# EAGLE design TeamFlag (EAGLE 7.6.0)
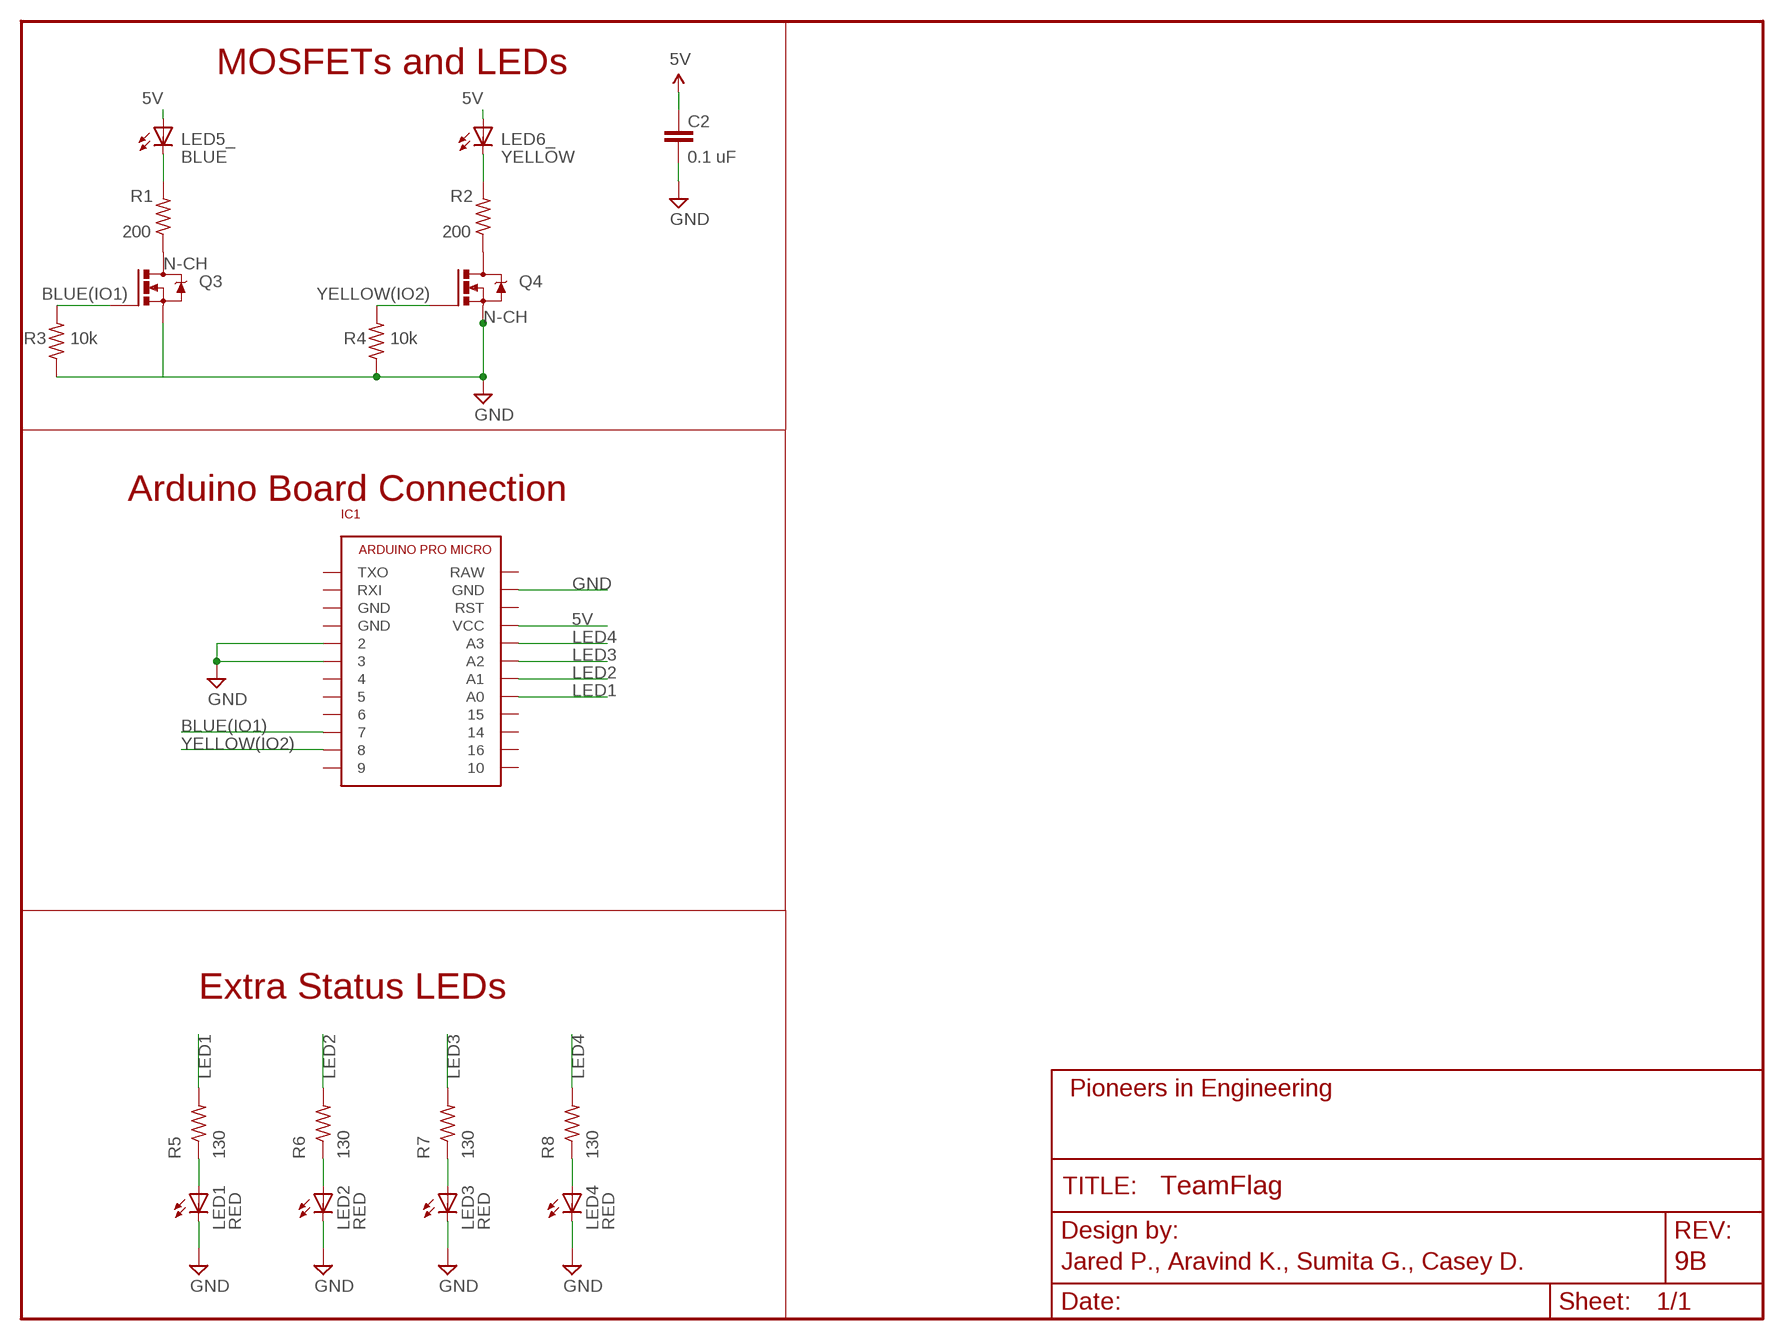
[diagram p0: schematic, sheet 1]
FRAME1 (FRAME_SCHEMATIC): AUTHOR: Jared P., Aravind K., Sumita G., Casey D.; REVISION: 9B

## Parts
C2  0.1 uF  CAP0603-CAP  [0603-CAP]
IC1  ARDUINO_PRO_MICROSMD  [ARDUINO_PRO_MICRO_SM]
LED1  RED  LED0805  [LED-0805]
LED2  RED  LED0805  [LED-0805]
LED3  RED  LED0805  [LED-0805]
LED4  RED  LED0805  [LED-0805]
LED5_  BLUE  LEDLED5MM-NOFLAT  [LED5MM-NOFLAT]
LED6_  YELLOW  LEDLED5MM-NOFLAT  [LED5MM-NOFLAT]
Q3  N-CH  N-CHANNEL-MOSFETSOT23-3  [SOT23-3]
Q4  N-CH  N-CHANNEL-MOSFETSOT23-3  [SOT23-3]
R1  200  R-US_R0603  [R0603]
R2  200  R-US_R0603  [R0603]
R3  10k  R-US_R0603  [R0603]
R4  10k  R-US_R0603  [R0603]
R5  130  R-US_R0603  [R0603]
R6  130  R-US_R0603  [R0603]
R7  130  R-US_R0603  [R0603]
R8  130  R-US_R0603  [R0603]

## Nets
5V: C2.1 IC1.VCC LED5_.A LED6_.A
BLUE(IO1): IC1.7 Q3.1(G) R3.2
BSOURCE: Q3.3(D) R1.1
GND: C2.2 IC1.2 IC1.3 IC1.GND@2(GND) LED1.C LED2.C LED3.C LED4.C Q3.2(S) Q4.2(S) R3.1 R4.1
LED1: IC1.A0 R5.2
LED1R: LED1.A R5.1
LED2: IC1.A1 R6.2
LED2R: LED2.A R6.1
LED3: IC1.A2 R7.2
LED3R: LED3.A R7.1
LED4: IC1.A3 R8.2
LED4R: LED4.A R8.1
N$2: LED5_.K(C) R1.2
N$3: LED6_.K(C) R2.2
YELLOW(IO2): IC1.8 Q4.1(G) R4.2
YSOURCE: Q4.3(D) R2.1
Unconnected: IC1.4 IC1.5 IC1.6 IC1.9 IC1.10 IC1.14 IC1.15 IC1.16 IC1.GND IC1.GND@1(GND) IC1.RAW IC1.RST IC1.RX(RXI) IC1.TX(TXO)

## Notes on the sheet
- MOSFETs and LEDs
- Arduino Board Connection
- Extra Status LEDs

## Library data of the parts
C2 = pie:CAP: Capacitor Standard 0603 ceramic capacitor, and 0.1" leaded capacitor.; PIE-INT-REF-NUM: CAPACITOR-GENERIC
IC1 = pie:ARDUINO_PRO_MICRO: Arduino Pro Micro Electrical System Year 9's Smart Sensor Core Pin Outs <https://cdn.sparkfun.com/assets/9/c/3/c/4/523a1765757b7f5c6e8b4567.png> Buy Here <http://www.aliexpress.com/item/Mini-Leonardo-Pro-Micro-ATmega32U4-5V-16MHz-Module-For-Arduino-Best-Quality/32284746884.html?ws_ab_test=searchweb201556_8,searchweb201602_2_10057_10056_10065_10055_10054_10067_10069_10059_10058_10017_10070_10060_10061_10052_10062_10053_10050_10051,searchweb201603_1&btsid=45993952-29ca-4de4-a0fb-c7fb72b8e1a5> Thru Hole Female Pins <http://www.digikey.com/product-search/en?keywords=929974E-01-12-ND> Surface Mount Female Pins <http://www.digikey.com/product-detail/en/sullins-connector-solutions/NPTC121KFXC-RC/S5604-ND/776062>
LED1-LED4 LED5_ LED6_ = pie:LED: LEDs Standard schematic elements and footprints for 5mm, 3mm, 1206, and 0603 sized LEDs. 5mm - Spark Fun Electronics SKU : COM-00529 (and others); PIE-INT-REF-NUM: LED
Q3 Q4 = pie:N-CHANNEL-MOSFET: N-channel TrenchMOS (TM) logic level FET Source: SOT23-3: http://www.nxp.com/documents/data_sheet/BSS123.pdf SOT669: http://www.nxp.com/documents/data_sheet/PH7030L.pdf
R1-R8 = pie:R-US_: RESISTOR, American symbol; DESCRIPTION: RESISTOR, American symbol; DISTRIBUTOR: DigiKey; MANUFACTURER: Rohm Semiconductor; NOTES: Cut Tape; PACKAGE: R0603; VALUE: >VALUE

## Board
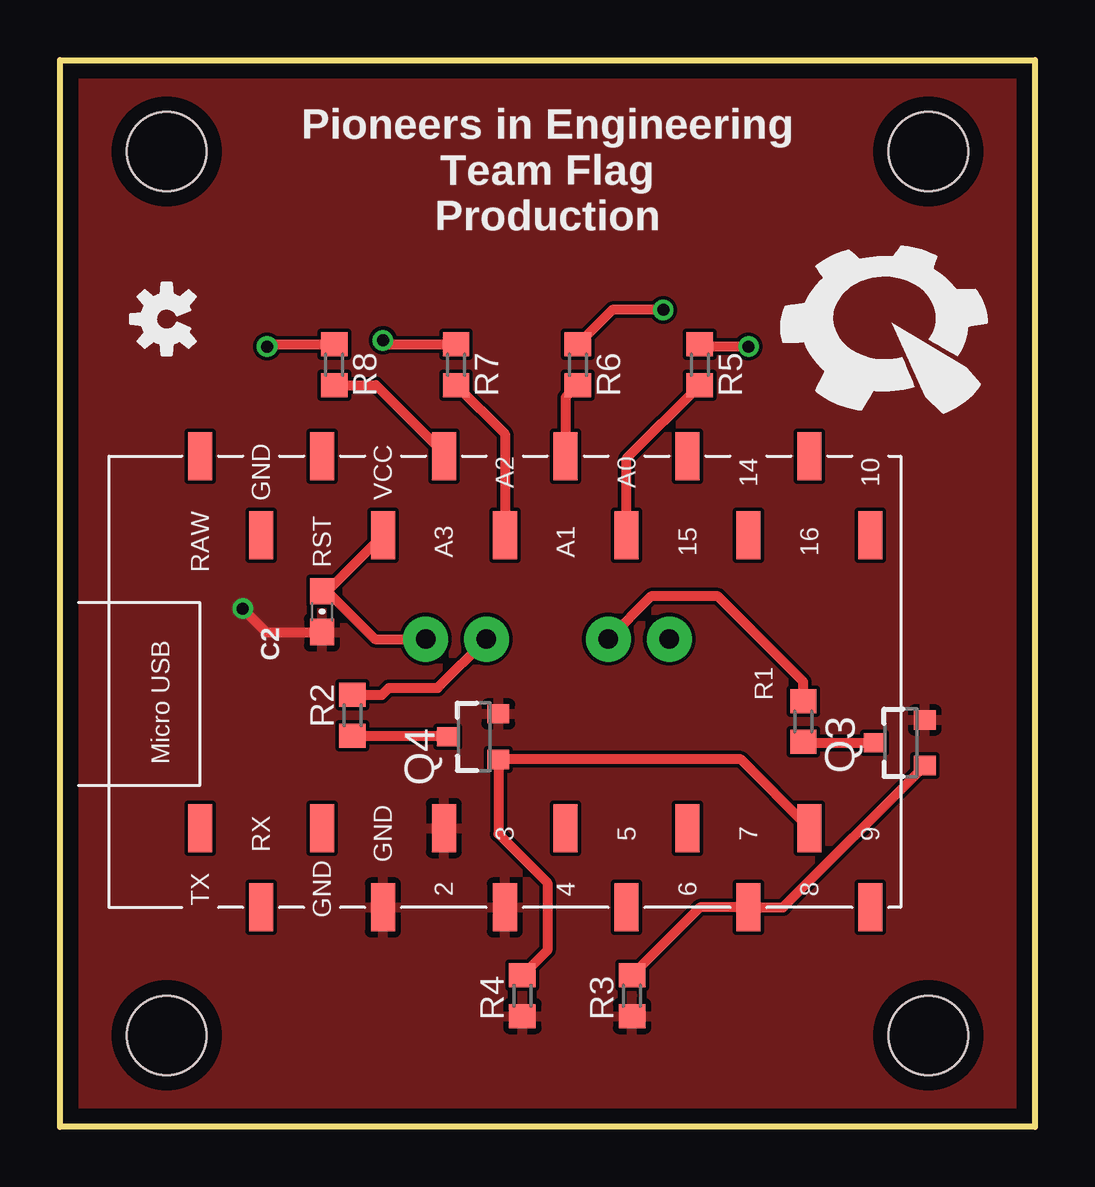
[diagram p1: board, top side]
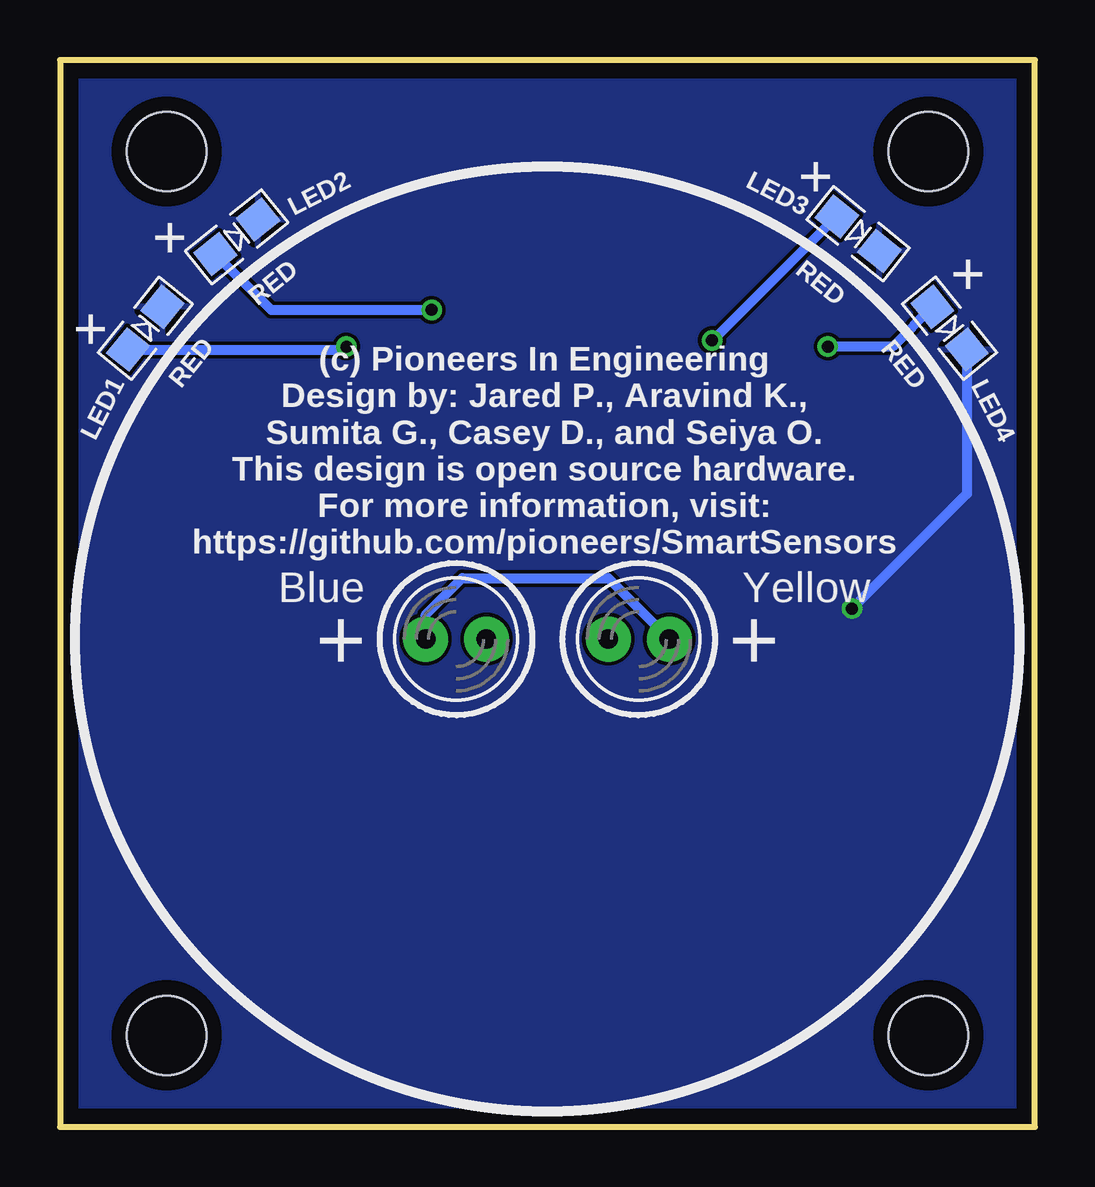
[diagram p2: board, bottom side, seen from below]

Size 40.64 x 44.45 mm. Coordinates in mm from the lower left corner, seen from the top.
Outline: 40.64,0 0,0 0,44.45 40.64,44.45 40.64,0
Copper layers (1*16): Top 2mil / dielectric 9mil / Bottom 2mil
Design rules "advancedcircuits-33each-pie": minimum track width 6mil, minimum drill 15mil, track to track 6mil, track to pad 6mil, pad to pad 6mil, via to via 6mil, smd to smd 6mil, copper to edge 25mil, drill to drill 7mil, minimum pad ring 7mil, minimum via ring 7mil, stop-mask expansion 3mil, vias tented up to drill 21mil, thermal gap 10mil

### Footprints (pad centres in the part's own frame; a part is rotated, then mirrored left to right if it is on the bottom)
0603-CAP = smd 1.1 x 1: 1 -0.85,0; 2 0.85,0
ARDUINO_PRO_MICRO_SM = smd 2 x 1: 2 3.302,19.05; 3 0,16.51; 4 3.302,13.97; 5 0,11.43; 6 3.302,8.89; 7 0,6.35; 8 3.302,3.81; 9 0,1.27; 10 15.494,1.27; 14 15.494,6.35; 15 18.796,8.89; 16 18.796,3.81; A0 15.494,11.43; A1 18.796,13.97; A2 15.494,16.51; A3 18.796,19.05; GND 15.494,26.67; GND@1 3.302,24.13; GND@2 0,21.59; RAW 18.796,29.21; RST 18.796,24.13; RX 0,26.67; TX 3.302,29.21; VCC 15.494,21.59
LED-0805 = smd 1.397 x 1.245: A -1.143,0; C 1.143,0
LED5MM-NOFLAT = drill 0.813 pad 1.88: A -1.27,0; K 1.27,0
SOT23-3 = smd 0.8 x 0.9: 1 -0.95,-1; 2 0.95,-1; 3 0,1.1
R0603 = smd 1 x 1.1: 1 -0.85,0; 2 0.85,0
STAND-OFF = hole 3.302: 0,0

### Placement (x,y rotation side)
C2  10.92,21.46 270 top
IC1  35.05,9.14 90 top
LED1  37.08,33.27 51 bottom
LED2  33.27,37.08 39 bottom
LED3  7.37,37.21 321 bottom
LED4  3.56,33.27 309 bottom
LED5_  24.13,20.32 0 bottom
LED6_  16.51,20.32 180 bottom
Q3  35.05,16 90 top
Q4  17.27,16.26 90 top
R1  30.99,16.89 90 top
R2  12.19,17.14 90 top
R3  23.85,5.46 90 top
R4  19.28,5.46 90 top
R5  26.67,31.75 270 top
R6  21.59,31.75 270 top
R7  16.51,31.75 270 top
R8  11.43,31.75 270 top
U$1  [PIE-LOGO-SMALL]  34.67,33.53 0 top
U$2  [OSHW-LOGO-S]  4.45,33.66 90 top
U$11  [STAND-OFF]  36.2,40.64 0 top
U$12  [STAND-OFF]  4.45,40.64 0 top
U$13  [STAND-OFF]  4.45,3.81 0 top
U$14  [STAND-OFF]  36.2,3.81 0 top

### Tracks (layer width: path | path; a pad name or v marks a point on that pad's centre or on a via)
5V
  Top 0.406: IC1.VCC 11.14,22.31 | 11.14,22.31 C2.1 | 11.14,22.31 13.13,20.32 LED6_.A
  Bottom 0.406: 14.99,20.57 LED6_.A 17.78,22.86 23.88,22.86 25.4,21.34 LED5_.A
BLUE(IO1)
  Top 0.406: Q3.1 30.14,9.14 IC1.7 26.68,9.14 R3.2
BSOURCE
  Top 0.406: 30.95,16 R1.1 31.03,16 Q3.3
GND  (via drill 0.5)
  Top 0.406: v7.62,21.59 8.6,20.61 C2.2
  Bottom 0.406: LED4.C 2.84,26.37 v7.62,21.59
  pour Top: 0,44.45 40.64,44.45 40.64,0 0,0
  pour Bottom (rank 2): 40.64,0 0,0 0,44.45 40.64,44.45
LED1
  Top 0.406: IC1.A0 23.62,27.85 R5.2
LED1R  (via drill 0.5)
  Top 0.406: v28.7,32.51 26.76,32.51 R5.1
  Bottom 0.406: LED1.A 28.83,32.39 v28.7,32.51
LED2
  Top 0.406: R6.2 21.08,30.39 IC1.A1
LED2R  (via drill 0.5)
  Top 0.406: v25.15,34.04 23.03,34.04 R6.1
  Bottom 0.406: LED2.A 31.83,34.04 v25.15,34.04
LED3
  Top 0.406: R7.2 18.54,28.87 IC1.A2
LED3R  (via drill 0.5)
  Top 0.406: v13.46,32.77 13.63,32.6 R7.1
  Bottom 0.406: LED3.A 13.42,32.77 v13.46,32.77
LED4
  Top 0.406: R8.2 13.17,30.9 16,28.07 IC1.A3
LED4R  (via drill 0.5)
  Top 0.406: v8.64,32.51 8.72,32.6 R8.1
  Bottom 0.406: LED4.A 5.93,32.51 v8.64,32.51
N$2
  Top 0.406: LED5_.K 24.64,22.1 27.43,22.1 30.99,18.54 R1.2
N$3
  Top 0.406: R2.2 13.42,18 13.72,18.29 15.75,18.29 LED6_.K
YELLOW(IO2)
  Top 0.406: R4.2 20.32,7.35 20.32,10.16 18.27,12.21 Q4.1 28.38,15.31 IC1.8
YSOURCE
  Top 0.406: R2.1 16.17,16.3 Q4.3

### Text on the board
tPlace: Pioneers in Engineering / Team Flag / Production
bPlace: + | + | + | + | (c) Pioneers In Engineering / Design by: Jared P., Aravind K., / Sumita G., Casey D., and Seiya O. / This design is open source hardware. / For more information, visit: / https://github.com/pioneers/SmartSensors | Yellow | Blue